# EAGLE design dotinvaders_main (EAGLE 5.10)
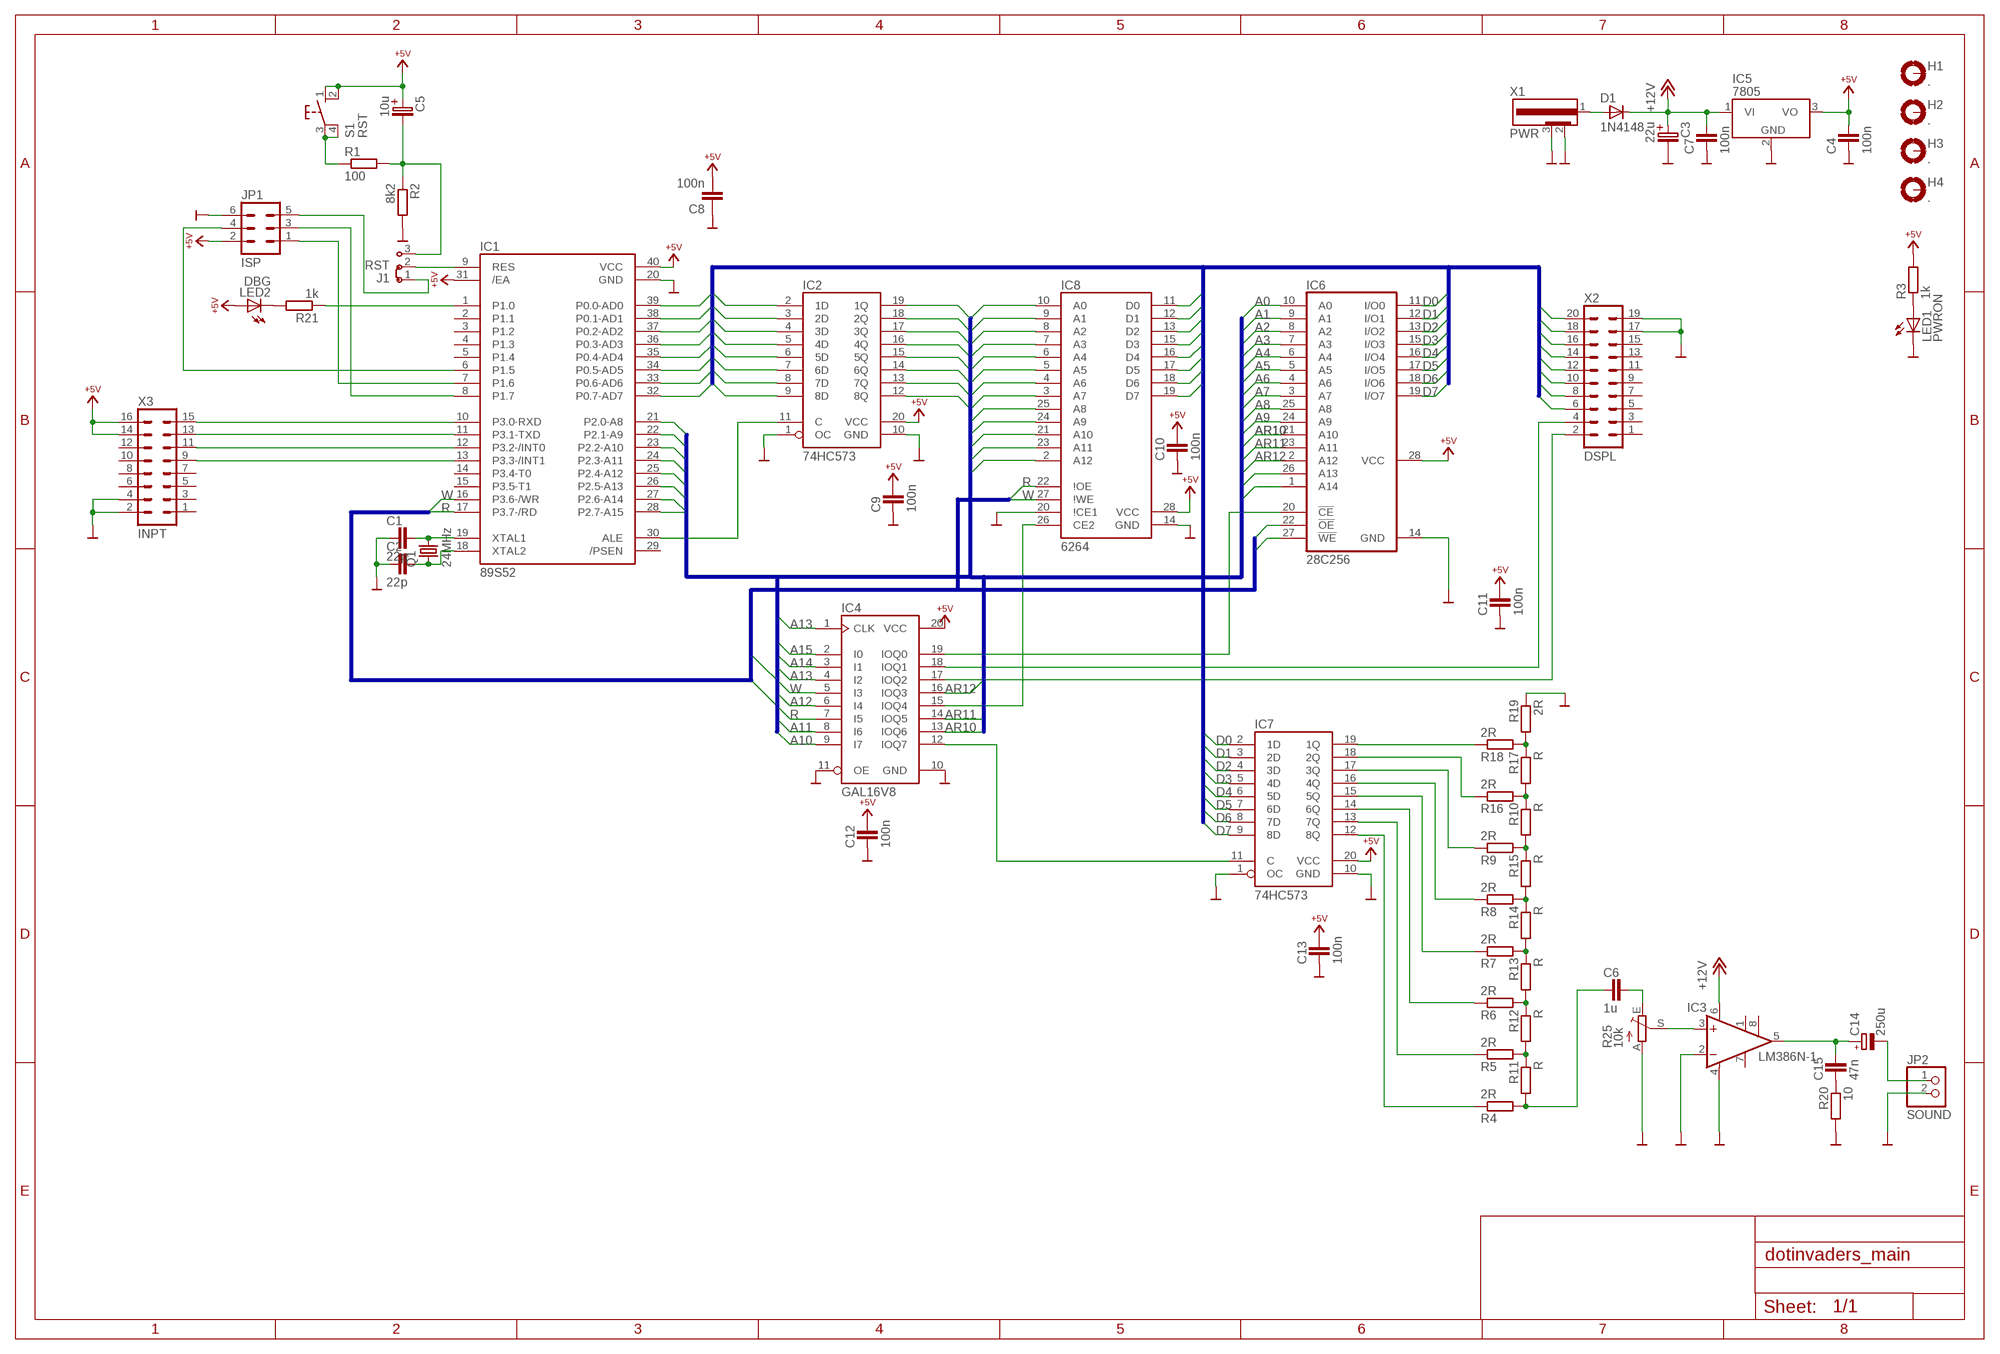
[diagram p0: schematic, sheet 1]

## Parts
C1  22p  C2,5  [C2,5]
C2  22p  C2,5  [C2,5]
C3  22u  ELKO2,5  [ELKO2,5]
C4  100n  C2,5  [C2,5]
C5  10u  ELKO2,5  [ELKO2,5]
C6  1u  C-2,5  [C-2,5]
C7  100n  C2,5  [C2,5]
C8  100n  C-EU050-024X044  [C050-024X044]
C9  100n  C-2,5  [C-2,5]
C10  100n  C-2,5  [C-2,5]
C11  100n  C-2,5  [C-2,5]
C12  100n  C-2,5  [C-2,5]
C13  100n  C-2,5  [C-2,5]
C14  250u  CPOL-EUE5-10.5  [E5-10,5]
C15  47n  C-2,5  [C-2,5]
D1  1N4148  1N4007  [DO41]
H1  .  BO3,0  [BO3,0]
H2  .  BO3,0  [BO3,0]
H3  .  BO3,0  [BO3,0]
H4  .  BO3,0  [BO3,0]
IC1  89S52  80C32  [DIL40]
IC2  74HC573  74573  [DIL20]
IC3  LM386N-1  [DIL08]
IC4  GAL16V8  16V8  [DIL20]
IC5  7805  [TO220]
IC6  28C256  [DIL28]
IC7  74HC573  74573  [DIL20]
IC8  6264  [DIL28]
J1  RST  J1X3  [J1X3]
JP1  ISP  MA3X2  [MA3X2]
JP2  SOUND  PINHD-1X2  [1X02]
LED1  PWRON  LED5MM  [LED5MM]
LED2  DBG  LED5MM  [LED5MM]
Q1  24MHz  Q  [HC49U-S]
R1  100  R-EU_R0805  [R0805]
R2  8k2  R-EU_R0805  [R0805]
R3  1k  R-EU_R0805  [R0805]
R4  2R  R-EU_R0805  [R0805]
R5  2R  R-EU_R0805  [R0805]
R6  2R  R-EU_R0805  [R0805]
R7  2R  R-EU_R0805  [R0805]
R8  2R  R-EU_R0805  [R0805]
R9  2R  R-EU_R0805  [R0805]
R10  R  R-EU_R0805  [R0805]
R11  R  R-EU_R0805  [R0805]
R12  R  R-EU_R0805  [R0805]
R13  R  R-EU_R0805  [R0805]
R14  R  R-EU_R0805  [R0805]
R15  R  R-EU_R0805  [R0805]
R16  2R  R-EU_M0805  [M0805]
R17  R  R-EU_R0805  [R0805]
R18  2R  R-EU_R0805  [R0805]
R19  2R  R-EU_R0805  [R0805]
R20  10  R-EU_0204/2V  [0204V]
R21  1k  R-EU_0204/5  [0204/5]
R25  10k  TRIM_EU-S64Y  [S64Y]
S1  RST  KEY3305  [KEY3305]
X1  PWR  DC-CON  [DC-CON]
X2  DSPL  MA10X2  [MA10X2]
X3  INPT  MA8X2  [MA8X2]

## Nets
+5V: C4.2 C5.+ C8.2 C9.2 C10.2 C11.2 C12.2 C13.2 IC1.31(/EA) IC1.40(VCC) IC2.20(VCC) IC4.20(VCC) IC5.3(VO) IC6.28(VCC) IC7.20(VCC) IC8.28(VCC) JP1.2 LED2.A R3.2 S1.1 S1.2 X3.14 X3.16
+12V: C3.+ C7.2 D1.C IC3.6(VS) IC5.1(VI)
A0: IC2.19(1Q) IC6.10(A0) IC8.10(A0)
A1: IC2.18(2Q) IC6.9(A1) IC8.9(A1)
A2: IC2.17(3Q) IC6.8(A2) IC8.8(A2)
A3: IC2.16(4Q) IC6.7(A3) IC8.7(A3)
A4: IC2.15(5Q) IC6.6(A4) IC8.6(A4)
A5: IC2.14(6Q) IC6.5(A5) IC8.5(A5)
A6: IC2.13(7Q) IC6.4(A6) IC8.4(A6)
A7: IC2.12(8Q) IC6.3(A7) IC8.3(A7)
A8: IC1.21(P2.0-A8) IC6.25(A8) IC8.25(A8)
A9: IC1.22(P2.1-A9) IC6.24(A9) IC8.24(A9)
A10: IC1.23(P2.2-A10) IC4.9(I7)
A11: IC1.24(P2.3-A11) IC4.8(I6)
A12: IC1.25(P2.4-A12) IC4.6(I4)
A13: IC1.26(P2.5-A13) IC4.1(CLK) IC4.4(I2) IC6.26(A13)
A14: IC1.27(P2.6-A14) IC4.3(I1) IC6.1(A14)
A15: IC1.28(P2.7-A15) IC4.2(I0)
AR10: IC4.13(IOQ6) IC6.21(A10) IC8.21(A10)
AR11: IC4.14(IOQ5) IC6.23(A11) IC8.23(A11)
AR12: IC4.16(IOQ3) IC6.2(A12) IC8.2(A12)
D0: IC1.39(P0.0-AD0) IC2.2(1D) IC6.11(I/O0) IC7.2(1D) IC8.11(D0) X2.20
D1: IC1.38(P0.1-AD1) IC2.3(2D) IC6.12(I/O1) IC7.3(2D) IC8.12(D1) X2.18
D2: IC1.37(P0.2-AD2) IC2.4(3D) IC6.13(I/O2) IC7.4(3D) IC8.13(D2) X2.16
D3: IC1.36(P0.3-AD3) IC2.5(4D) IC6.15(I/O3) IC7.5(4D) IC8.15(D3) X2.14
D4: IC1.35(P0.4-AD4) IC2.6(5D) IC6.16(I/O4) IC7.6(5D) IC8.16(D4) X2.12
D5: IC1.34(P0.5-AD5) IC2.7(6D) IC6.17(I/O5) IC7.7(6D) IC8.17(D5) X2.10
D6: IC1.33(P0.6-AD6) IC2.8(7D) IC6.18(I/O6) IC7.8(7D) IC8.18(D6) X2.8
D7: IC1.32(P0.7-AD7) IC2.9(8D) IC6.19(I/O7) IC7.9(8D) IC8.19(D7) X2.6
GND: C1.1 C2.1 C3.- C4.1 C7.1 C8.1 C9.1 C10.1 C11.1 C12.1 C13.1 IC1.20(GND) IC2.1(OC) IC2.10(GND) IC3.2(-IN) IC3.4(GND) IC4.10(GND) IC4.11(OE) IC5.2(GND) IC6.14(GND) IC7.1(OC) IC7.10(GND) IC8.14(GND) IC8.20(\!CE1) JP1.6 JP2.2 LED1.K(C) R2.2 R19.1 R20.2 R25.A X1.2 X1.3 X2.17 X2.19 X3.2 X3.4
N$1: IC1.30(ALE) IC2.11(C)
N$2: D1.A X1.1
N$3: C1.2 IC1.19(XTAL1) Q1.2
N$4: C2.2 IC1.18(XTAL2) Q1.1
N$5: C6.2 R25.E
N$6: IC4.12(IOQ7) IC7.11(C)
N$7: C6.1 R4.2 R11.2
N$8: LED1.A R3.1
N$9: IC4.19(IOQ0) IC6.20(!CE)
N$10: C5.- J1.3 R1.2 R2.1
N$11: R1.1 S1.3 S1.4
N$12: J1.1 JP1.5
N$13: IC1.8(P1.7) JP1.3
N$14: IC1.7(P1.6) JP1.1
N$15: IC1.6(P1.5) JP1.4
N$16: IC1.9(RES) J1.2
N$17: IC4.15(IOQ4) IC8.26(CE2)
N$18: IC7.18(2Q) R16.1
N$19: IC4.18(IOQ1) X2.4
N$20: IC4.17(IOQ2) X2.2
N$21: IC7.17(3Q) R9.1
N$22: IC7.16(4Q) R8.1
N$23: IC7.15(5Q) R7.1
N$24: IC7.14(6Q) R6.1
N$25: IC3.3(+IN) R25.S
N$26: R5.2 R11.1 R12.2
N$27: R6.2 R12.1 R13.2
N$28: R7.2 R13.1 R14.2
N$29: R8.2 R14.1 R15.2
N$30: R9.2 R10.2 R15.1
N$31: IC1.10(P3.0-RXD) X3.15
N$32: IC1.11(P3.1-TXD) X3.13
N$33: IC1.12(P3.2-/INT0) X3.11
N$34: IC1.13(P3.3-/INT1) X3.9
N$35: R10.1 R16.2 R17.2
N$36: R17.1 R18.2 R19.2
N$37: IC7.13(7Q) R5.1
N$38: IC7.12(8Q) R4.1
N$39: C14.+ C15.2 IC3.5(OUT)
N$40: C15.1 R20.1
N$41: C14.- JP2.1
N$42: IC7.19(1Q) R18.1
N$44: LED2.K(C) R21.2
N$45: IC1.1(P1.0) R21.1
R: IC1.17(P3.7-/RD) IC4.7(I5) IC6.22(!OE) IC8.22(\!OE)
W: IC1.16(P3.6-/WR) IC4.5(I3) IC6.27(!WE) IC8.27(\!WE)
Unconnected: H1.B3,0(MOUNT) H2.B3,0(MOUNT) H3.B3,0(MOUNT) H4.B3,0(MOUNT) IC1.2(P1.1) IC1.3(P1.2) IC1.4(P1.3) IC1.5(P1.4) IC1.14(P3.4-T0) IC1.15(P3.5-T1) IC1.29(/PSEN) IC3.1(GAIN) IC3.7(BYPASS) IC3.8(GAIN) X2.1 X2.3 X2.5 X2.7 X2.9 X2.11 X2.13 X2.15 X3.1 X3.3 X3.5 X3.6 X3.7 X3.8 X3.10 X3.12

## Buses
AD:A[0..15],AR[8..15]
D[0..7]
RW:R,W

## Library data of the parts
C1 C2 C4 C7 = 8032mini:C2,5
C3 C5 = 8032mini:ELKO2,5
C6 C9-C13 C15 = 89S52mini2:C-2,5
C8 = rcl:C-EU: CAPACITOR, European symbol
C14 = rcl:CPOL-EU: POLARIZED CAPACITOR, European symbol
D1 = 8032mini:1N4007
H1-H4 = 8032mini:BO3,0
IC1 = 8032mini:80C32
IC2 IC7 = 8032mini:74573
IC3 = dotinvaders:LM386?-*: Low Voltage Audio Power Amplifier Source: http://cache.national.com/ds/LM/LM386.pdf
IC4 = 8032mini:16V8
IC5 = 8032mini:7805
IC6 = dotinvaders:28C256
IC8 = 89S52mini2:6264
J1 = 89S52mini2:J1X3
JP1 = 89S52mini2:MA3X2
JP2 = pinhead:PINHD-1X2: PIN HEADER
LED1 LED2 = led:LED: LED OSRAM: - CHIPLED LG R971, LG N971, LY N971, LG Q971, LY Q971, LO R971, LY R971 LH N974, LH R974 LS Q976, LO Q976, LY Q976 LO Q996 - Hyper CHIPLED LW Q18S LB Q993, LB Q99A, LB R99A - SideLED LS A670, LO A670, LY A670, LG A670, LP A670 LB A673, LV A673, LT A673, LW A673 LH A674 LY A675 LS A676, LA A676, LO A676, LY A676, LW A676 LS A679, LY A679, LG A679 - Hyper Micro SIDELED® LS Y876, LA Y876, LO Y876, LY Y876 LT Y87S - SmartLED LW L88C, LW L88S LB L89C, LB L89S, LG L890 LS L89K, LO L89K, LY L89K LS L896, LA L896, LO L896, LY L896 - TOPLED LS T670, LO T670, LY T670, LG T670, LP T670 LSG T670, LSP T670, LSY T670, LOP T670, LYG T670 LG T671, LOG T671, LSG T671 LB T673, LV T673, LT T673, LW T673 LH T674 LS T676, LA T676, LO T676, LY T676, LB T676, LH T676, LSB T676, LW T676 LB T67C, LV T67C, LT T67C, LS T67K, LO T67K, LY T67K, LW E67C LS E67B, LA E67B, LO E67B, LY E67B, LB E67C, LV E67C, LT E67C LW T67C LS T679, LY T679, LG T679 LS T770, LO T770, LY T770, LG T770, LP T770 LB T773, LV T773, LT T773, LW T773 LH T774 LS E675, LA E675, LY E675, LS T675 LS T776, LA T776, LO T776, LY T776, LB T776 LHGB T686 LT T68C, LB T68C - Hyper Mini TOPLED® LB M676 - Mini TOPLED Santana® LG M470 LS M47K, LO M47K, LY M47K Source: http://www.osram.convergy.de LUXEON: - LUMILED® LXK2-PW12-R00, LXK2-PW12-S00, LXK2-PW14-U00, LXK2-PW14-V00 LXK2-PM12-R00, LXK2-PM12-S00, LXK2-PM14-U00 LXK2-PE12-Q00, LXK2-PE12-R00, LXK2-PE12-S00, LXK2-PE14-T00, LXK2-PE14-U00 LXK2-PB12-K00, LXK2-PB12-L00, LXK2-PB12-M00, LXK2-PB14-N00, LXK2-PB14-P00, LXK2-PB14-Q00 LXK2-PR12-L00, LXK2-PR12-M00, LXK2-PR14-Q00, LXK2-PR14-R00 LXK2-PD12-Q00, LXK2-PD12-R00, LXK2-PD12-S00 LXK2-PH12-R00, LXK2-PH12-S00 LXK2-PL12-P00, LXK2-PL12-Q00, LXK2-PL12-R00 Source: www.luxeon.com KINGBRIGHT: KA-3528ASYC Source: www.kingbright.com
Q1 = 8032mini:Q
R1-R21 = rcl:R-EU_: RESISTOR, European symbol
R25 = pot:TRIM_EU-: POTENTIOMETER
S1 = 8032mini:KEY3305
X1 = 8032mini:DC-CON
X2 = 89S52mini2:MA10X2
X3 = 89S52mini2:MA8X2

## Board
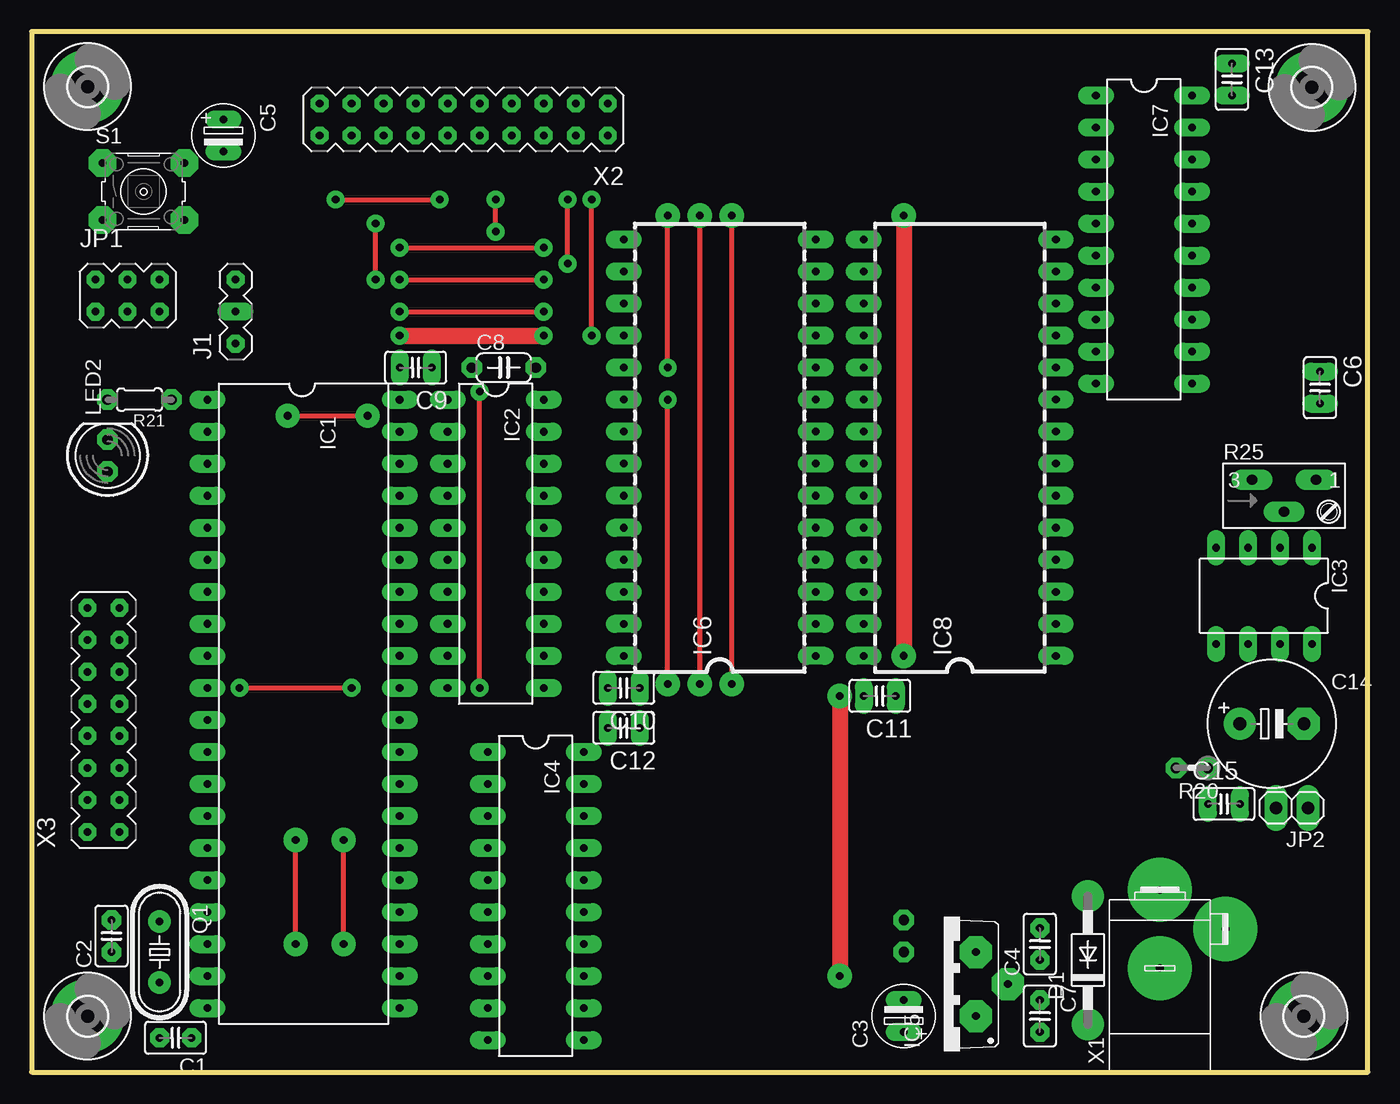
[diagram p1: board, top side]
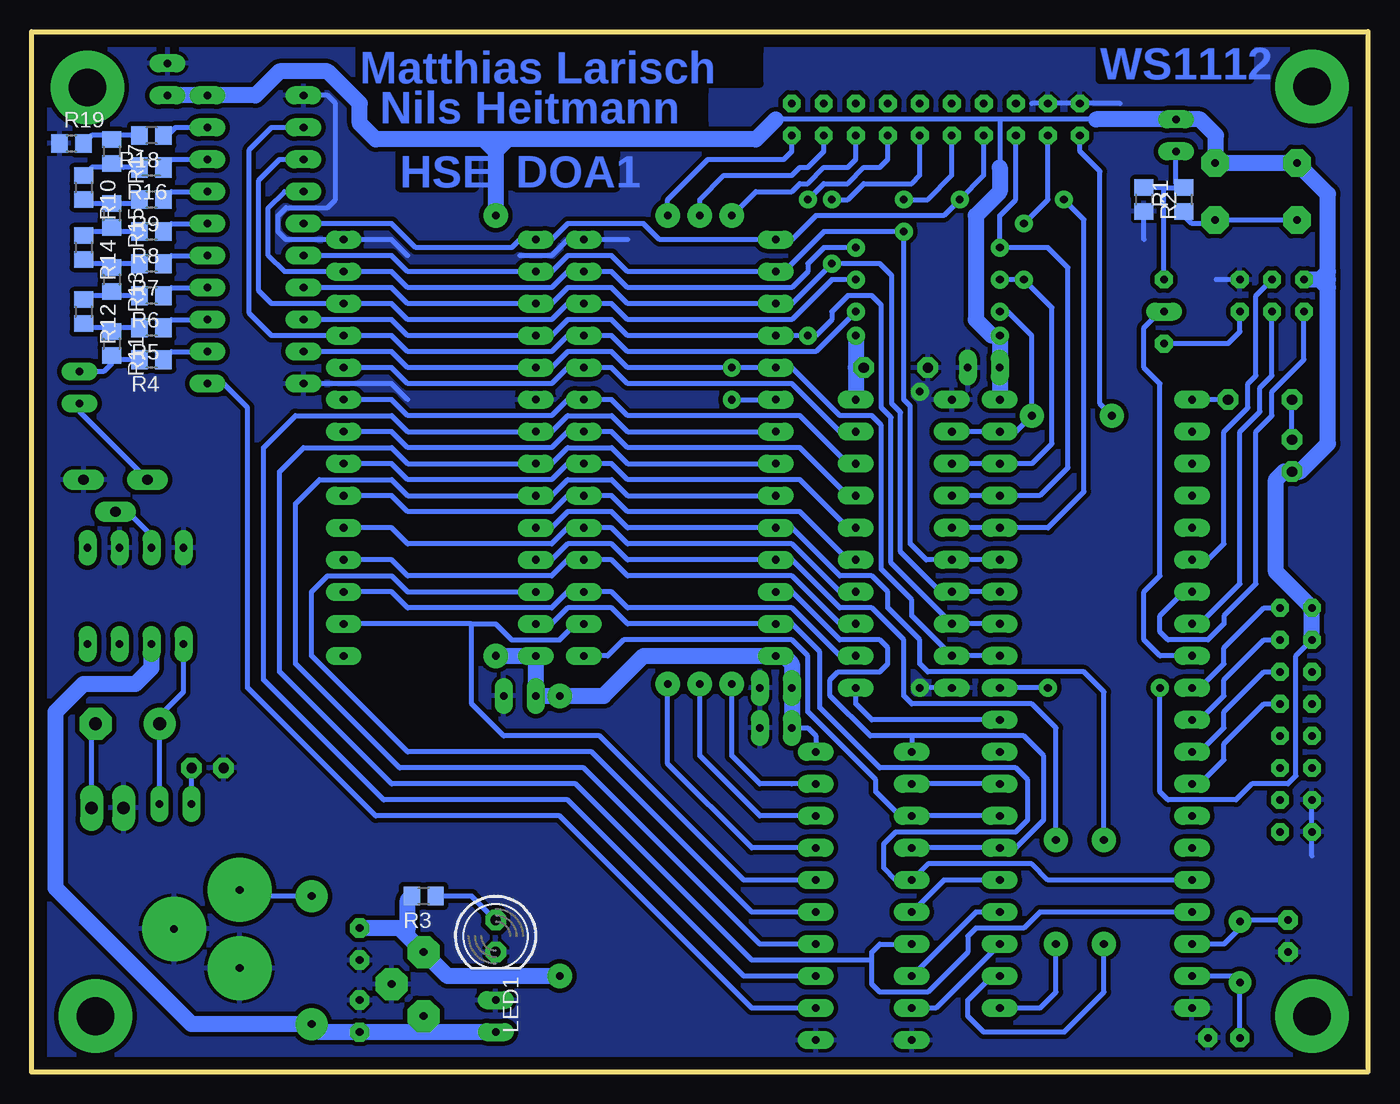
[diagram p2: board, bottom side, seen from below]

Size 106.04 x 82.54 mm. Coordinates in mm from the lower left corner, seen from the top.
Outline: 0,0 106.04,0 106.04,82.54 0,82.54 0,0
Copper layers (1*16): Top 0.035mm / dielectric 1.5mm / Bottom 0.035mm
Design rules "default *": minimum track width 16mil, minimum drill 10mil, track to track 14mil, track to pad 14mil, pad to pad 14mil, via to via 14mil, smd to smd 8mil, copper to edge 40mil, drill to drill 8mil, minimum pad ring 16mil, minimum via ring 16mil, stop-mask expansion 4mil, vias tented up to drill 0mil, thermal gap 10mil

### Footprints (pad centres in the part's own frame; a part is rotated, then mirrored left to right if it is on the bottom)
C2,5 = drill 0.61 pad 1.524 octagon: 1 -1.27,0; 2 1.27,0
ELKO2,5 = drill 0.61 pad 1.422 long: + -1.27,0; - 1.27,0
C-2,5 = drill 0.6 pad 1.422 long: 1 -1.27,0; 2 1.27,0
C050-024X044 = drill 0.813 octagon: 1 -2.54,0; 2 2.54,0
E5-10,5 = drill 1.016 pad 2.54 round: + -2.54,0 | drill 1.016 pad 2.54 octagon: - 2.54,0
DO41 = drill 0.61 pad 2.54 round: A 5.08,0; C -5.08,0
BO3,0 = drill 3 pad 5.842 round: B3,0 0,0
DIL40 = drill 0.61 pad 1.422 long: 1 -24.13,-7.62; 2 -21.59,-7.62; 3 -19.05,-7.62; 4 -16.51,-7.62; 5 -13.97,-7.62; 6 -11.43,-7.62; 7 -8.89,-7.62; 8 -6.35,-7.62; 9 -3.81,-7.62; 10 -1.27,-7.62; 11 1.27,-7.62; 12 3.81,-7.62; 13 6.35,-7.62; 14 8.89,-7.62; 15 11.43,-7.62; 16 13.97,-7.62; 17 16.51,-7.62; 18 19.05,-7.62; 19 21.59,-7.62; 20 24.13,-7.62; 21 24.13,7.62; 22 21.59,7.62; 23 19.05,7.62; 24 16.51,7.62; 25 13.97,7.62; 26 11.43,7.62; 27 8.89,7.62; 28 6.35,7.62; 29 3.81,7.62; 30 1.27,7.62; 31 -1.27,7.62; 32 -3.81,7.62; 33 -6.35,7.62; 34 -8.89,7.62; 35 -11.43,7.62; 36 -13.97,7.62; 37 -16.51,7.62; 38 -19.05,7.62; 39 -21.59,7.62; 40 -24.13,7.62
DIL20 = drill 0.61 pad 1.422 long: 1 -11.43,-3.81; 2 -8.89,-3.81; 3 -6.35,-3.81; 4 -3.81,-3.81; 5 -1.27,-3.81; 6 1.27,-3.81; 7 3.81,-3.81; 8 6.35,-3.81; 9 8.89,-3.81; 10 11.43,-3.81; 11 11.43,3.81; 12 8.89,3.81; 13 6.35,3.81; 14 3.81,3.81; 15 1.27,3.81; 16 -1.27,3.81; 17 -3.81,3.81; 18 -6.35,3.81; 19 -8.89,3.81; 20 -11.43,3.81
DIL08 = drill 0.6 pad 1.422 long: 1 -3.81,-3.81; 2 -1.27,-3.81; 3 1.27,-3.81; 4 3.81,-3.81; 5 3.81,3.81; 6 1.27,3.81; 7 -1.27,3.81; 8 -3.81,3.81
TO220 = drill 0.61 pad 2.54 octagon: 1 -2.54,0; 2 0,-2.54; 3 2.54,0
DIL28 = drill 0.6 pad 1.422 long: 1 -16.51,-7.62; 2 -13.97,-7.62; 3 -11.43,-7.62; 4 -8.89,-7.62; 5 -6.35,-7.62; 6 -3.81,-7.62; 7 -1.27,-7.62; 8 1.27,-7.62; 9 3.81,-7.62; 10 6.35,-7.62; 11 8.89,-7.62; 12 11.43,-7.62; 13 13.97,-7.62; 14 16.51,-7.62; 15 16.51,7.62; 16 13.97,7.62; 17 11.43,7.62; 18 8.89,7.62; 19 6.35,7.62; 20 3.81,7.62; 21 1.27,7.62; 22 -1.27,7.62; 23 -3.81,7.62; 24 -6.35,7.62; 25 -8.89,7.62; 26 -11.43,7.62; 27 -13.97,7.62; 28 -16.51,7.62
J1X3 = drill 0.6 pad 1.27 octagon: 1 -2.54,0; 3 2.54,0 | drill 0.6 pad 1.422 long: 2 0,0
MA3X2 = drill 0.6 pad 1.27 octagon: 1 -2.54,-1.27; 2 -2.54,1.27; 3 0,-1.27; 4 0,1.27; 5 2.54,-1.27; 6 2.54,1.27
1X02 = drill 1.016 long: 1 -1.27,0; 2 1.27,0
LED5MM = drill 0.813 octagon: A -1.27,0; K 1.27,0
HC49U-S = drill 0.61 pad 1.778 round: 1 -2.413,0; 2 2.413,0
R0805 = smd 1.3 x 1.5: 1 -0.95,0; 2 0.95,0
M0805 = smd 1.3 x 1.6: 1 -0.95,0; 2 0.95,0
0204V = drill 0.813 octagon: 1 -1.27,0; 2 1.27,0
0204/5 = drill 0.813 octagon: 1 -2.54,0; 2 2.54,0
S64Y = drill 0.813 long: A 2.54,1.27; E -2.54,1.27; S 0,-1.27
KEY3305 = drill 0.61 pad 2.184 octagon: 1 -3.251,2.261; 2 3.251,2.261; 3 -3.251,-2.261; 4 3.251,-2.261
DC-CON = drill 0.61 pad 5.08 round: 1 6.2,0; 2 3.1,-5.2; 3 0,0
MA10X2 = drill 0.6 pad 1.27 octagon: 1 -11.43,-1.27; 2 -11.43,1.27; 3 -8.89,-1.27; 4 -8.89,1.27; 5 -6.35,-1.27; 6 -6.35,1.27; 7 -3.81,-1.27; 8 -3.81,1.27; 9 -1.27,-1.27; 10 -1.27,1.27; 11 1.27,-1.27; 12 1.27,1.27; 13 3.81,-1.27; 14 3.81,1.27; 15 6.35,-1.27; 16 6.35,1.27; 17 8.89,-1.27; 18 8.89,1.27; 19 11.43,-1.27; 20 11.43,1.27
MA8X2 = drill 0.6 pad 1.27 octagon: 1 -8.89,-1.27; 2 -8.89,1.27; 3 -6.35,-1.27; 4 -6.35,1.27; 5 -3.81,-1.27; 6 -3.81,1.27; 7 -1.27,-1.27; 8 -1.27,1.27; 9 1.27,-1.27; 10 1.27,1.27; 11 3.81,-1.27; 12 3.81,1.27; 13 6.35,-1.27; 14 6.35,1.27; 15 8.89,-1.27; 16 8.89,1.27

### Placement (x,y rotation side)
C1  11.43,2.72 180 top
C2  6.35,10.79 90 top
C3  69.22,4.45 90 top
C4  80.01,10.16 90 top
C5  15.24,74.3 270 top
C6  102.24,54.29 270 top
C7  80.01,4.45 270 top
C8  37.47,55.88 0 top
C9  30.48,55.88 180 top
C10  46.99,30.48 180 top
C11  67.31,29.84 180 top
C12  46.99,27.3 180 top
C13  95.25,78.74 270 top
C14  98.43,27.62 0 top
C15  94.62,21.27 0 top
D1  83.82,8.89 90 top
H1  100.97,4.45 0 top
H2  101.6,78.1 0 top
H3  4.45,78.17 0 top
H4  4.45,4.45 0 top
IC1  21.59,29.21 270 top
IC2  36.83,41.91 270 top
IC3  97.79,37.78 180 top
IC4  40.01,13.97 270 top
IC5  74.93,6.98 90 top
IC6  54.61,49.53 90 top
IC7  88.26,66.04 270 top
IC8  73.66,49.53 90 top
J1  16.19,60.33 90 top
JP1  7.62,61.6 0 top
JP2  100.01,20.95 180 top
LED1  69.22,10.79 270 bottom
LED2  6.03,48.9 90 top
Q1  10.16,9.53 270 top
R1  14.61,69.21 90 bottom
R2  17.78,69.21 270 bottom
R3  74.93,13.97 180 bottom
R4  96.52,56.52 180 bottom
R5  96.52,59.05 180 bottom
R6  96.52,61.6 180 bottom
R7  96.52,64.14 180 bottom
R8  96.52,66.67 180 bottom
R9  96.52,69.21 180 bottom
R10  101.92,70.17 270 bottom
R11  99.69,57.79 270 bottom
R12  101.92,60.33 270 bottom
R13  99.69,62.87 270 bottom
R14  101.92,65.41 270 bottom
R15  99.69,67.94 270 bottom
R16  96.52,71.75 180 bottom
R17  99.69,73.02 270 bottom
R18  96.52,74.3 180 bottom
R19  102.87,73.66 0 bottom
R20  92.07,24.13 180 top
R21  8.57,53.34 180 top
R25  99.38,45.72 0 top
S1  8.89,69.85 0 top
X1  89.53,8.26 90 top
X2  34.29,75.56 180 top
X3  5.71,27.94 90 top

### Tracks (layer width: path | path; a pad name or v marks a point on that pad's centre or on a via)
+5V  (via drill 0.6, 0.6 pad 1.93, 0.61, 0.61 pad 1.93)
  Top 0.406: v16.51,30.48 v25.4,30.48
  Top 1.27: v29.21,58.42 v40.64,58.42 | v69.22,67.94 v69.22,33.02 | v64.13,29.84 v64.13,7.62
  Bottom 0.406: 12.42,72.39 S1.2 12.07,72.19 | 76.2,11.43 76.84,11.43 | IC4.20 43.81,26.67 44.45,27.3 C12.2 | 3.18,62.87 3.81,62.87 | IC6.28 46.35,33.02 | v25.4,30.48 IC1.31 | v16.51,30.48 16.51,22.22 15.88,21.59 10.48,21.59 9.21,22.86 6.35,22.86 5.71,23.5 5.71,33.02 X3.14 | LED2.A 6.35,47.62 | 21.59,75.56 29.21,75.56 | 29.21,75.56 46.99,75.56 | 29.21,75.56 29.21,71.75
  Bottom 1.27: v40.64,58.42 40.64,55.88 | 40.64,55.88 IC2.20 | X3.14 X3.16 7.3,39.69 7.3,46.99 6.67,47.62 LED2.A 5.4,47.62 3.18,49.85 3.18,62.23 | S1.2 S1.1 3.18,69.65 3.18,63.5 | 76.2,10.79 IC5.3 73.03,7.62 v64.13,7.62 | 76.2,10.79 76.2,11.43 76.2,13.65 R3.2 | C4.2 76.84,11.43 76.2,10.79 | v69.22,33.02 IC8.28 C11.2 v64.13,29.84 60.64,29.84 57.47,33.02 IC6.28 | 69.22,73.98 69.22,73.02 | 69.22,73.02 v69.22,67.94 | C12.2 C10.2 45.72,32.38 46.35,33.02 | C13.2 IC7.20 88.26,77.47 86.36,79.38 82.55,79.38 80.01,76.83 80.01,75.25 78.74,73.98 70.17,73.98 | 12.07,72.19 12.07,74.3 13.34,75.56 C5.+ 21.59,75.56 | 40.64,55.88 C8.2 | 68.26,73.98 69.22,73.98 | 3.18,62.23 3.18,62.87 3.18,63.5 | 3.81,62.87 JP1.2 | IC1.40 C9.2 v29.21,58.42 29.84,58.42 31.12,59.69 31.12,67.94 29.21,69.85 29.21,71.75 | 69.22,73.02 70.17,73.98 | 69.22,73.98 70.17,73.98 | 68.26,73.98 69.22,73.02 | 3.18,62.23 3.81,62.87 | 3.81,62.87 3.18,63.5 | 68.26,73.98 48.58,73.98 46.99,75.56
+12V
  Bottom 0.406: 74.93,3.17 IC5.1
  Bottom 1.27: C3.+ 74.93,3.17 C7.2 83.19,3.17 D1.C 93.34,3.81 104.14,14.61 104.14,28.57 101.92,30.8 97.79,30.8 96.52,32.07 IC3.6
A0
  Bottom 0.406: IC2.19 41.91,50.8 45.72,54.61 58.74,54.61 60.01,55.88 IC6.10 63.5,55.88 64.77,54.61 76.2,54.61 77.47,55.88 IC8.10
A1
  Bottom 0.406: IC2.18 41.27,48.26 45.09,52.07 58.74,52.07 60.01,53.34 IC6.9 | IC8.9 77.47,53.34 76.2,52.07 64.77,52.07 63.5,53.34 IC6.9 | IC6.9 62.87,53.34
A2
  Bottom 0.406: IC2.17 41.27,45.72 45.09,49.53 58.74,49.53 60.01,50.8 IC6.8 63.5,50.8 64.77,49.53 76.2,49.53 77.47,50.8 IC8.8
A3
  Bottom 0.406: IC2.16 41.27,43.18 45.09,46.99 58.74,46.99 60.01,48.26 IC6.7 63.5,48.26 64.77,46.99 76.2,46.99 77.47,48.26 IC8.7
A4
  Bottom 0.406: IC2.15 41.27,40.64 45.09,44.45 58.74,44.45 60.01,45.72 IC6.6 63.5,45.72 64.77,44.45 76.2,44.45 77.47,45.72 IC8.6
A5
  Bottom 0.406: IC2.14 41.91,38.1 45.72,41.91 58.74,41.91 60.01,43.18 IC6.5 63.5,43.18 64.77,41.91 76.2,41.91 77.47,43.18 IC8.5
A6
  Bottom 0.406: IC8.4 77.47,40.64 76.2,39.37 64.77,39.37 63.5,40.64 IC6.4 60.01,40.64 58.74,39.37 45.72,39.37 41.91,35.56 IC2.13
A7
  Bottom 0.406: IC8.3 77.47,38.1 76.2,36.83 64.77,36.83 63.5,38.1 IC6.3 60.01,38.1 58.74,36.83 45.72,36.83 41.91,33.02 IC2.12
A8  (via drill 0.61 pad 1.93)
  Top 0.406: v24.77,10.16 v24.77,18.41
  Bottom 0.406: IC8.25 64.77,40.64 63.5,41.91 60.01,41.91 58.74,40.64 IC6.25 45.72,40.64 41.91,36.83 39.37,36.83 36.83,34.29 36.83,29.84 36.2,29.21 26.67,29.21 24.77,27.3 v24.77,18.41 | IC1.21 26.04,5.08 24.77,6.35 v24.77,10.16
A9  (via drill 0.61 pad 1.93)
  Top 0.406: v20.96,10.16 v20.96,18.41
  Bottom 0.406: IC8.24 64.77,43.18 63.5,44.45 60.01,44.45 58.74,43.18 IC6.24 45.72,43.18 41.91,39.37 39.37,39.37 38.1,38.1 38.1,36.83 35.56,34.29 35.56,32.38 34.92,31.75 22.54,31.75 20.96,30.16 v20.96,18.41 | IC1.22 29.84,7.62 31.75,5.71 31.75,4.45 30.48,3.17 24.13,3.17 20.96,6.35 v20.96,10.16
A10
  Bottom 0.406: IC4.9 34.29,5.08 IC1.23
A11
  Bottom 0.406: IC1.24 31.12,12.7 IC4.8
A12
  Bottom 0.406: IC1.25 33.66,15.24 IC4.6
A13
  Bottom 0.406: 36.2,26.67 27.3,26.67 25.72,25.08 25.72,20 27.94,17.78 IC1.26 IC4.4 | 36.2,26.67 39.5,26.67 42.67,29.84 42.67,31.11 42.04,31.75 38.73,31.75 38.1,32.38 38.1,33.66 38.73,34.29 41.91,34.29 45.72,38.1 IC6.26 | 36.2,26.67 IC4.1
A14
  Bottom 0.406: IC1.27 IC4.3 37.15,20.32 39.05,22.22 39.05,23.18 44.45,28.57 44.45,33.02 45.72,34.29 59.05,34.29 60.33,33.02 IC6.1
A15
  Bottom 0.406: IC1.28 IC4.2
AR10
  Bottom 0.406: IC4.13 49.53,7.62 63.5,21.59 78.1,21.59 87.63,31.11 87.63,49.53 85.09,52.07 77.47,52.07 76.2,50.8 IC8.21 64.77,50.8 63.5,52.07 60.01,52.07 58.74,50.8 IC6.21
AR11
  Bottom 0.406: IC4.14 48.26,10.16 62.23,24.13 76.84,24.13 85.09,32.38 85.09,45.09 83.19,46.99 77.47,46.99 76.2,45.72 IC8.23 64.77,45.72 63.5,46.99 60.01,46.99 58.74,45.72 IC6.23
AR12
  Bottom 0.406: 71.12,35.56 69.22,35.56 67.94,34.29 64.13,34.29 62.87,35.56 IC6.2 | 71.12,35.56 IC8.2 | IC4.16 49.53,15.24 60.96,26.67 68.58,26.67 71.12,29.21 71.12,35.56
D0  (via drill 0.61, 0.61 pad 1.93)
  Top 0.406: v29.21,60.33 v40.64,60.33 | v20.32,52.07 v26.67,52.07
  Bottom 0.406: IC2.2 IC1.39 27.94,50.8 v26.67,52.07 26.67,58.42 28.57,60.33 v29.21,60.33 | IC7.2 87,74.93 88.77,73.15 88.77,60.2 87,58.42 IC8.11 77.47,58.42 76.2,57.15 64.77,57.15 63.5,58.42 IC6.11 60.01,58.42 58.74,57.15 43.81,57.15 v40.64,60.33 | X2.20 22.86,73.02 21.27,71.44 21.27,53.02 v20.32,52.07
D1  (via drill 0.61)
  Top 0.406: v29.21,62.87 v40.64,62.87 | v27.3,62.87 v27.3,67.31
  Bottom 0.406: IC2.3 IC1.38 26.67,48.26 25.08,49.85 25.08,60.64 v27.3,62.87 v29.21,62.87 | IC7.3 86.36,72.39 88.01,70.74 88.01,61.98 87,60.96 IC8.12 77.47,60.96 76.2,59.69 64.77,59.69 63.5,60.96 IC6.12 60.01,60.96 58.74,59.69 45.72,59.69 42.55,62.87 v40.64,62.87 | X2.18 25.4,69.21 v27.3,67.31
D2  (via drill 0.61)
  Top 0.406: v29.21,65.41 v40.64,65.41
  Bottom 0.406: IC2.4 IC1.37 26.04,45.72 23.81,47.94 23.81,63.82 25.4,65.41 v29.21,65.41 29.21,67.94 27.94,69.21 X2.16 | v40.64,65.41 43.18,65.41 44.45,64.14 44.45,63.5 45.72,62.23 58.74,62.23 60.01,63.5 IC6.13 63.5,63.5 64.77,62.23 76.2,62.23 77.47,63.5 IC8.13 85.98,63.5 87.25,64.77 87.25,68.58 85.98,69.85 IC7.4
D3  (via drill 0.6)
  Top 0.406: v24.13,69.21 v32.39,69.21
  Bottom 0.406: IC2.5 IC1.36 25.4,43.18 22.54,46.04 22.54,67.63 v24.13,69.21 | IC7.5 77.47,67.31 76.2,66.04 75.56,65.41 67.94,65.41 67.31,66.04 IC8.15 64.77,66.04 63.5,67.31 57.47,67.31 56.2,66.04 IC6.15 45.72,66.04 43.81,67.94 33.66,67.94 v32.39,69.21 30.48,71.12 X2.14
D4  (via drill 0.61)
  Top 0.406: v36.83,66.67 v36.83,69.21
  Bottom 0.406: IC1.35 IC2.6 35.05,40.64 36.32,41.91 36.32,52.83 36.83,53.34 v36.83,66.67 43.18,66.67 46.35,63.5 IC6.16 58.74,63.5 60.01,64.77 63.5,64.77 64.77,63.5 IC8.16 76.2,63.5 77.47,64.77 IC7.6 | X2.12 33.02,71.12 34.92,69.21 v36.83,69.21
D5  (via drill 0.61)
  Top 0.406: v42.55,64.14 v42.55,69.21
  Bottom 0.406: IC1.34 IC2.7 33.91,38.1 37.08,41.28 37.08,52.32 37.78,53.02 37.78,63.18 38.73,64.14 v42.55,64.14 45.72,60.96 IC6.17 58.74,60.96 60.01,62.23 63.5,62.23 64.77,60.96 IC8.17 76.2,60.96 77.47,62.23 IC7.7 | X2.10 35.56,71.12 36.2,70.48 40.01,70.48 41.27,69.21 v42.55,69.21
D6  (via drill 0.61)
  Top 0.406: v44.45,58.42 v44.45,69.21
  Bottom 0.406: IC1.33 IC2.8 37.85,40.39 37.85,51.94 38.61,52.71 38.61,60.83 39.37,61.6 41.27,61.6 42.55,60.33 42.55,59.69 43.81,58.42 v44.45,58.42 IC6.18 58.74,58.42 60.01,59.69 63.5,59.69 64.77,58.42 IC8.18 76.2,58.42 77.47,59.69 IC7.8 | X2.8 38.1,72.39 38.73,71.75 40.01,71.75 41.27,70.48 43.18,70.48 v44.45,69.21
D7  (via drill 0.61, 0.61 pad 1.93)
  Top 0.406: v50.48,55.88 v50.48,67.94
  Bottom 0.406: IC1.32 IC2.9 36.2,36.2 36.2,37.47 38.61,39.88 38.61,51.31 39.37,52.07 41.91,52.07 45.72,55.88 IC6.19 v50.48,55.88 58.74,55.88 60.01,57.15 63.5,57.15 64.77,55.88 IC8.19 76.2,55.88 77.47,57.15 IC7.9 | v50.48,67.94 48.58,69.85 45.72,69.85 45.09,70.48 44.45,70.48 43.18,71.75 41.27,71.75 40.64,72.39 X2.6
GND  (via drill 0.6)
  Top 0.406: v35.56,30.48 v35.56,53.98
  Bottom 0.406: 76.2,53.34 77.47,54.61 IC7.10 | 76.2,64.77 77.47,66.04 IC8.14 85.85,66.04 86.49,66.67 86.49,67.94 85.85,68.58 82.55,68.58 81.91,69.21 81.91,76.83 82.55,77.47 IC7.1 | IC1.20 13.34,5.08 | X3.4 X3.2 4.45,17.14 | 19.69,76.83 X2.19 X2.17 26.67,76.83 | JP1.6 12.07,62.87 | 17.78,66.04 R2.2 | IC2.10 v35.56,30.48 | 67.31,64.77 64.77,64.77 63.5,66.04 IC6.14 58.74,66.04
  pour Bottom (isolate 0.356): 0,0 106.04,0 106.04,82.54 0,82.54
N$1
  Bottom 0.406: IC1.30 39.37,27.94 40.64,29.21 IC2.11
N$2
  Bottom 0.406: D1.A 89.05,13.97 X1.1
N$3
  Bottom 0.406: IC1.19 10.29,7.62 10.16,7.49 Q1.2 C1.2
N$4
  Bottom 0.406: IC1.18 11.43,10.16 10.16,11.43 | 10.16,11.43 Q1.1 | C2.2 9.53,12.06 10.16,11.43
N$5
  Bottom 0.406: C6.2 102.24,52.39 R25.E
N$6
  Bottom 0.406: IC4.12 48.9,5.08 64.13,20.32 78.74,20.32 88.9,30.48 88.9,52.71 90.81,54.61 IC7.11
N$7
  Bottom 0.406: R4.2 99.38,56.52 R11.2 99.69,56.2 100.33,55.56 C6.1
N$8
  Bottom 0.406: LED1.A 71.12,13.97 R3.1
N$9  (via drill 0.61, 0.61 pad 1.93)
  Top 0.406: v50.48,30.8 v50.48,53.34
  Bottom 0.406: 45.72,22.86 IC4.19 48.26,22.86 50.48,25.08 v50.48,30.8 | v50.48,53.34 IC6.20
N$10
  Bottom 0.406: C5.- 15.24,70.48 14.92,70.16 R1.2 16.19,70.16 | 16.19,70.16 R2.1 | J1.3 16.19,70.16
N$11
  Bottom 0.406: S1.3 S1.4 | S1.4 12.14,67.23 | S1.4 12.42,67.31 13.97,67.31 14.61,67.94 R1.1
N$12
  Bottom 0.406: J1.1 11.11,57.79 10.16,58.74 JP1.5
N$13
  Bottom 0.406: IC1.8 13.34,35.56 10.16,38.74 10.16,50.8 8.57,52.39 8.57,54.29 7.62,55.25 JP1.3
N$14
  Bottom 0.406: IC1.7 14.61,38.1 16.51,36.2 16.51,34.93 15.88,34.29 12.7,34.29 11.43,35.56 11.43,36.2 8.89,38.74 8.89,50.8 7.62,52.07 7.62,53.98 5.08,56.52 JP1.1
N$15
  Bottom 0.406: 13.34,40.64 IC1.6 12.7,40.64 11.43,41.91 11.43,50.8 9.53,52.71 9.53,54.61 8.89,55.25 8.89,61.6 JP1.4
N$16
  Bottom 0.406: IC1.9 16.51,33.02 17.78,34.29 17.78,38.1 16.51,39.37 16.51,54.61 17.78,55.88 17.78,59.05 16.83,60.01 16.51,60.01 J1.2
N$17
  Bottom 0.406: IC8.26 76.2,38.1 77.47,39.37 81.28,39.37 82.55,39.37 83.82,38.1 83.82,33.02 76.2,25.4 61.59,25.4 48.9,12.7 IC4.15
N$18
  Bottom 0.406: IC7.18 94.94,72.39 R16.1
N$19  (via drill 0.61 pad 1.93)
  Top 0.406: v53.02,30.8 v53.02,67.94
  Bottom 0.406: IC4.18 48.26,20.32 53.02,25.08 v53.02,30.8 | v53.02,67.94 53.02,69.21 51.12,71.12 45.72,71.12 45.09,71.75 44.45,71.75 43.18,73.02 X2.4
N$20  (via drill 0.61 pad 1.93)
  Top 0.406: v55.56,30.8 v55.56,67.94
  Bottom 0.406: IC4.17 48.9,17.78 55.56,24.45 v55.56,30.8 | v55.56,67.94 55.56,69.21 52.39,72.39 46.35,72.39 45.72,73.02 X2.2
N$21
  Bottom 0.406: IC7.17 94.94,69.85 R9.1
N$22
  Bottom 0.406: IC7.16 94.94,67.31 R8.1
N$23
  Bottom 0.406: IC7.15 94.94,64.77 R7.1
N$24
  Bottom 0.406: IC7.14 94.94,62.23 R6.1
N$25
  Bottom 0.406: IC3.3 96.52,42.55 98.11,44.13 99.06,44.13 R25.S
N$26
  Bottom 0.406: R5.2 99.69,59.05 | 99.69,59.05 101.6,59.05 R12.2 | 99.69,59.05 R11.1
N$27
  Bottom 0.406: R6.2 100.01,61.6 | 100.01,61.6 101.6,61.6 R12.1 | R13.2 100.01,61.6
N$28
  Bottom 0.406: R7.2 99.38,64.14 | 99.38,64.14 101.6,64.14 R14.2 | R13.1 | R13.1 100.01,63.5 | 99.38,64.14 R13.1
N$29
  Bottom 0.406: R8.2 99.69,66.67 | 99.69,66.67 101.6,66.67 | 101.6,66.67 R14.1 | 101.6,66.67 101.6,66.36 101.92,66.67 | 99.69,66.67 R15.2
N$30
  Bottom 0.406: R9.2 97.79,68.89 R15.1 101.59,68.89 R10.2
N$31
  Bottom 0.406: IC1.10 13.34,30.48 11.43,32.38 11.43,33.66 8.26,36.83 X3.15
N$32
  Bottom 0.406: IC1.11 13.34,27.94 11.43,29.84 11.43,31.11 8.26,34.29 X3.13
N$33
  Bottom 0.406: IC1.12 13.34,25.4 11.43,27.3 11.43,28.57 8.26,31.75 X3.11
N$34
  Bottom 0.406: IC1.13 13.34,22.86 11.43,24.77 11.43,26.04 8.26,29.21 X3.9
N$35
  Bottom 0.406: R16.2 98.74,71.75 99.38,71.75 | 99.38,71.75 R17.2 | 99.38,71.75 101.28,71.75 R10.1
N$36
  Bottom 0.406: R18.2 98.11,74.3 99.38,74.3 | 99.38,74.3 R17.1 | 99.38,74.3 101.28,74.3 R19.2
N$37
  Bottom 0.406: IC7.13 94.94,59.69 R5.1
N$38
  Bottom 0.406: IC7.12 94.94,57.15 R4.1
N$39
  Bottom 0.406: IC3.5 93.98,30.16 95.88,28.26 C14.+ C15.2
N$40
  Bottom 0.406: C15.1 R20.1
N$41
  Bottom 0.406: C14.- 101.28,27.3 JP2.1
N$42
  Bottom 0.406: IC7.19 94.62,74.93 95.25,74.3 R18.1
N$44
  Bottom 0.406: LED2.K R21.2
N$45
  Bottom 0.406: R21.1 IC1.1
R
  Bottom 0.406: 37.47,10.16 IC4.7 38.73,10.16 39.37,9.53 39.37,8.89 | IC1.17 26.04,12.7 27.3,11.43 31.12,11.43 31.75,10.79 31.75,9.53 34.92,6.35 38.73,6.35 39.37,6.98 39.37,8.89 | 39.37,8.89 48.9,8.89 62.87,22.86 77.47,22.86 86.36,31.75 86.36,47.62 84.46,49.53 77.47,49.53 76.2,48.26 IC8.22 64.77,48.26 63.5,49.53 60.01,49.53 58.74,48.26 IC6.22
W
  Bottom 0.406: IC1.16 25.4,15.24 26.67,16.51 34.92,16.51 IC4.5 37.47,15.24 38.42,16.19 38.42,18.1 37.47,19.05 27.94,19.05 26.99,20 26.99,23.18 27.94,24.13 38.73,24.13 43.5,28.89 43.5,33.34 45.72,35.56 IC6.27 58.74,35.56 60.01,36.83 63.5,36.83 64.77,35.56 IC8.27

### Text on the board
Bottom: WS1112 | Matthias Larisch | Nils Heitmann | DOA1 | HSE